# EasyEDA schematic Easy-CI-V.json
TITLE: ICOM CI-V to Arduino; REV: 1.0; Date: 2019-03-28; Sheet: 1/1; Drawn By: Dhiru + VU2SFJ; Company: PHARC
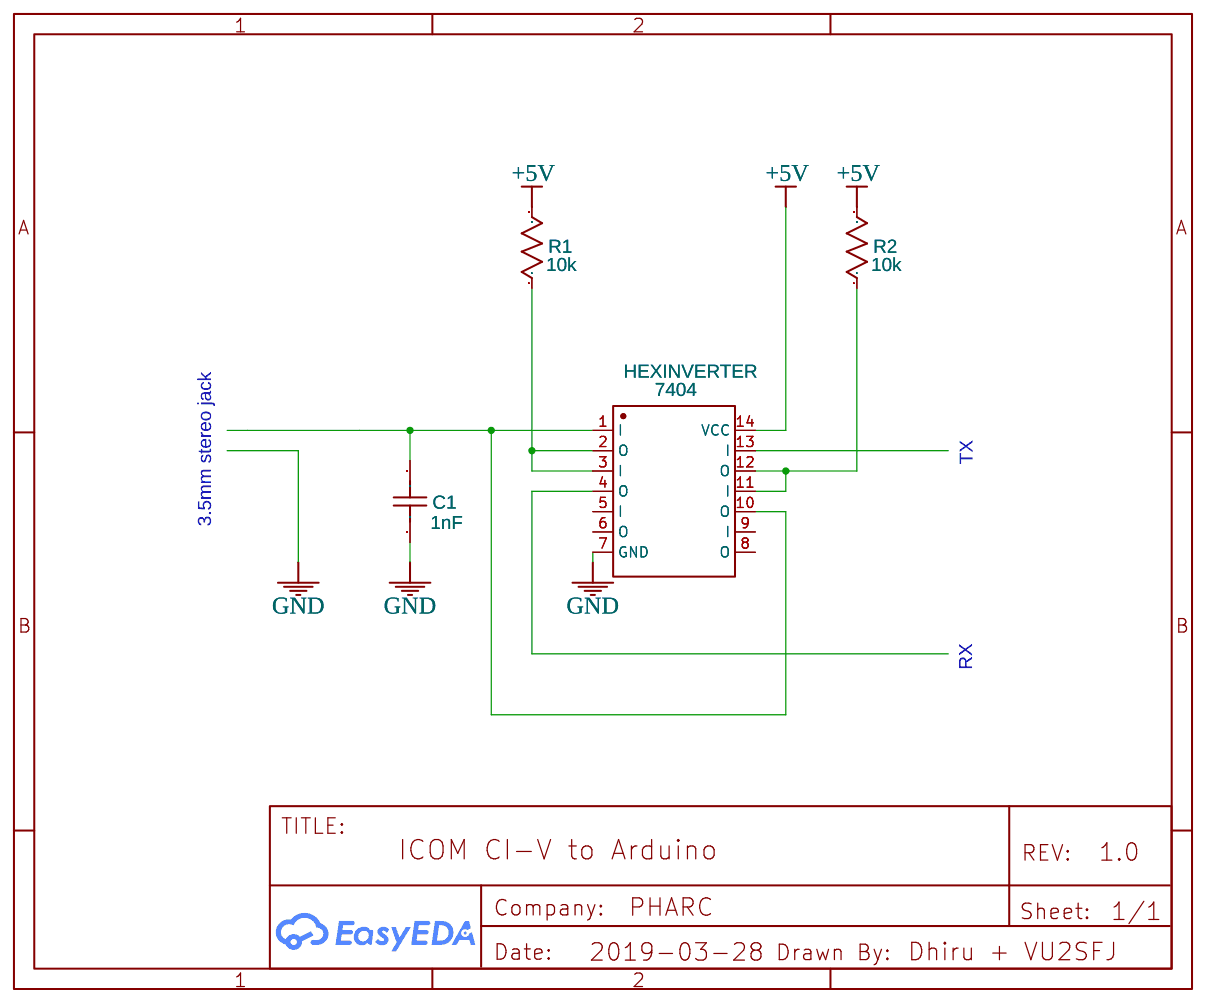
[diagram p0: schematic sheet]

## Parts
C1  1nF  [RAD-0.1]
HEXINVERTER  7404  [DIP14]
R1  10k  [AXIAL-0.3]
R2  10k  [AXIAL-0.3]

## Library data of the parts
C1 = Cap_RAD-0.1_US: Manufacturer Part: ?
HEXINVERTER = -: Manufacturer Part: ?
R1 R2 = Res_AXIAL-0.3(1/8W)_US: Manufacturer Part: ?

## Nets
+5V: HEXINVERTER.14(VCC) R1.2 R2.2
GND: C1.1 HEXINVERTER.7(GND)
Net-(C1-2): C1.2 HEXINVERTER.1(I) HEXINVERTER.10(O)
Net-(HEXINVERTER-2): HEXINVERTER.2(O) HEXINVERTER.3(I) R1.1
Net-(HEXINVERTER-11): HEXINVERTER.11(I) HEXINVERTER.12(O) R2.1

Not connected (* = marked no-connect by the designer): HEXINVERTER 4(O) 5(I) 6(O) 8(O) 9(I) 13(I)

## Notes on the sheet
- TX
- 3.5mm stereo jack
- RX
